# Altium schematic sheet MCH_FPGA_Decoupling.SchDoc: Metlino
size 420 x 297 mm; CheckedBy: P.Kulik,T.Przywozki,W.Ruclo; Author: G.Kasprowicz; CompanyName: WUT ISE; DrawnBy: G.Kasprowicz; Organization: WUT ISE; Address1: PW ISE; Address2: Nowowiejska 15/19 00-665 Warsaw; Address3: gkasprow@gmail.com; DocumentNumber: 11; Revision: 2; SheetNumber: 11; SheetTotal: 29; ModifiedBy: -; CheckedDate: -; Title2: FPGA decoupling; DivGrp: WUT ISE; Designer: G.Kasprowicz; ModifiedDate: -; ProjectName: Sensor Box
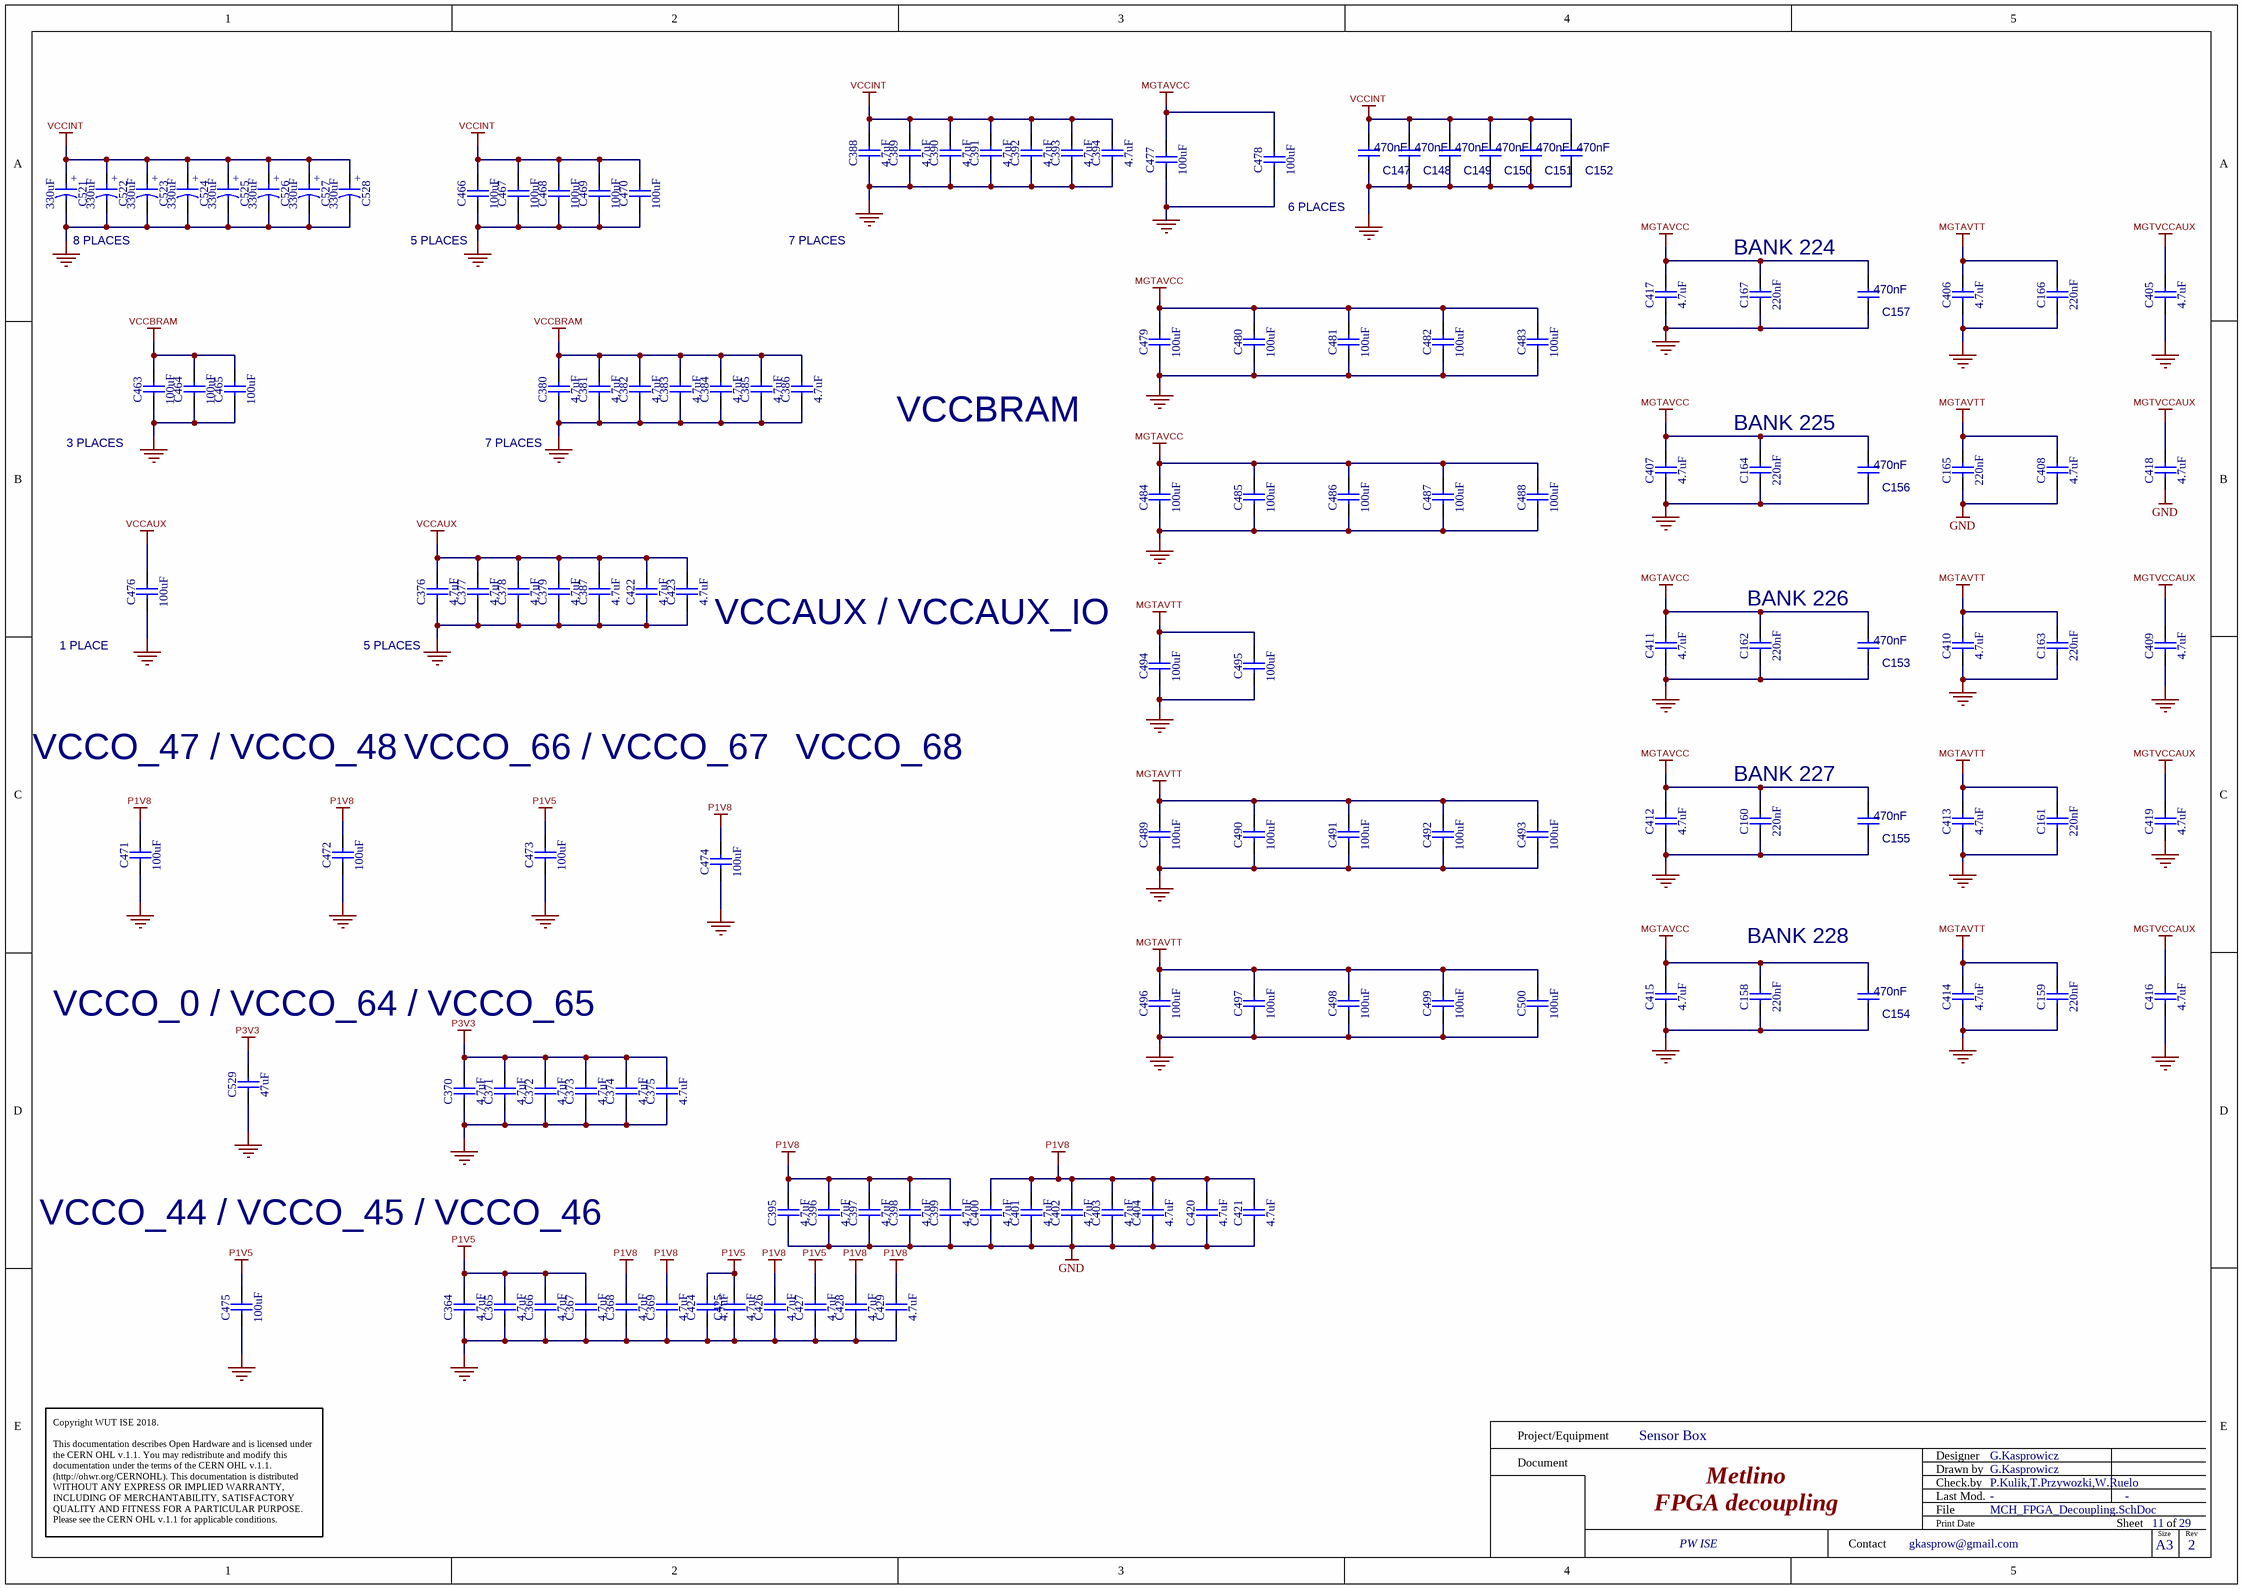
[diagram p0: MCH_FPGA_Decoupling.SchDoc]

## Parts
C147  470nF  [CAPC0603X33N]
C148  470nF  [CAPC0603X33N]
C149  470nF  [CAPC0603X33N]
C150  470nF  [CAPC0603X33N]
C151  470nF  [CAPC0603X33N]
C152  470nF  [CAPC0603X33N]
C153  470nF  [CAPC0603X33N]
C154  470nF  [CAPC0603X33N]
C155  470nF  [CAPC0603X33N]
C156  470nF  [CAPC0603X33N]
C157  470nF  [CAPC0603X33N]
C158  220nF  [CAPC0603X33N]
C159  220nF  [CAPC0603X33N]
C160  220nF  [CAPC0603X33N]
C161  220nF  [CAPC0603X33N]
C162  220nF  [CAPC0603X33N]
C163  220nF  [CAPC0603X33N]
C164  220nF  [CAPC0603X33N]
C165  220nF  [CAPC0603X33N]
C166  220nF  [CAPC0603X33N]
C167  220nF  [CAPC0603X33N]
C364  4.7uF  [CAPC1005X55N]
C365  4.7uF  [CAPC1005X55N]
C366  4.7uF  [CAPC1005X55N]
C367  4.7uF  [CAPC1005X55N]
C368  4.7uF  [CAPC1005X55N]
C369  4.7uF  [CAPC1005X55N]
C370  4.7uF  [CAPC1005X55N]
C371  4.7uF  [CAPC1005X55N]
C372  4.7uF  [CAPC1005X55N]
C373  4.7uF  [CAPC1005X55N]
C374  4.7uF  [CAPC1005X55N]
C375  4.7uF  [CAPC1005X55N]
C376  4.7uF  [CAPC1005X55N]
C377  4.7uF  [CAPC1005X55N]
C378  4.7uF  [CAPC1005X55N]
C379  4.7uF  [CAPC1005X55N]
C380  4.7uF  [CAPC1005X55N]
C381  4.7uF  [CAPC1005X55N]
C382  4.7uF  [CAPC1005X55N]
C383  4.7uF  [CAPC1005X55N]
C384  4.7uF  [CAPC1005X55N]
C385  4.7uF  [CAPC1005X55N]
C386  4.7uF  [CAPC1005X55N]
C387  4.7uF  [CAPC1005X55N]
C388  4.7uF  [CAPC1005X55N]
C389  4.7uF  [CAPC1005X55N]
C390  4.7uF  [CAPC1005X55N]
C391  4.7uF  [CAPC1005X55N]
C392  4.7uF  [CAPC1005X55N]
C393  4.7uF  [CAPC1005X55N]
C394  4.7uF  [CAPC1005X55N]
C395  4.7uF  [CAPC1005X55N]
C396  4.7uF  [CAPC1005X55N]
C397  4.7uF  [CAPC1005X55N]
C398  4.7uF  [CAPC1005X55N]
C399  4.7uF  [CAPC1005X55N]
C400  4.7uF  [CAPC1005X55N]
C401  4.7uF  [CAPC1005X55N]
C402  4.7uF  [CAPC1005X55N]
C403  4.7uF  [CAPC1005X55N]
C404  4.7uF  [CAPC1005X55N]
C405  4.7uF  [CAPC1005X55N]
C406  4.7uF  [CAPC1005X55N]
C407  4.7uF  [CAPC1005X55N]
C408  4.7uF  [CAPC1005X55N]
C409  4.7uF  [CAPC1005X55N]
C410  4.7uF  [CAPC1005X55N]
C411  4.7uF  [CAPC1005X55N]
C412  4.7uF  [CAPC1005X55N]
C413  4.7uF  [CAPC1005X55N]
C414  4.7uF  [CAPC1005X55N]
C415  4.7uF  [CAPC1005X55N]
C416  4.7uF  [CAPC1005X55N]
C417  4.7uF  [CAPC1005X55N]
C418  4.7uF  [CAPC1005X55N]
C419  4.7uF  [CAPC1005X55N]
C420  4.7uF  [CAPC1005X55N]
C421  4.7uF  [CAPC1005X55N]
C422  4.7uF  [CAPC1005X55N]
C423  4.7uF  [CAPC1005X55N]
C424  4.7uF  [CAPC1005X55N]
C425  4.7uF  [CAPC1005X55N]
C426  4.7uF  [CAPC1005X55N]
C427  4.7uF  [CAPC1005X55N]
C428  4.7uF  [CAPC1005X55N]
C429  4.7uF  [CAPC1005X55N]
C463  100uF  [CAPC3216X180N]
C464  100uF  [CAPC3216X180N]
C465  100uF  [CAPC3216X180N]
C466  100uF  [CAPC3216X180N]
C467  100uF  [CAPC3216X180N]
C468  100uF  [CAPC3216X180N]
C469  100uF  [CAPC3216X180N]
C470  100uF  [CAPC3216X180N]
C471  100uF  [CAPC3216X180N]
C472  100uF  [CAPC3216X180N]
C473  100uF  [CAPC3216X180N]
C474  100uF  [CAPC3216X180N]
C475  100uF  [CAPC3216X180N]
C476  100uF  [CAPC3216X180N]
C477  100uF  [CAPC3216X180N]
C478  100uF  [CAPC3216X180N]
C479  100uF  [CAPC3216X180N]
C480  100uF  [CAPC3216X180N]
C481  100uF  [CAPC3216X180N]
C482  100uF  [CAPC3216X180N]
C483  100uF  [CAPC3216X180N]
C484  100uF  [CAPC3216X180N]
C485  100uF  [CAPC3216X180N]
C486  100uF  [CAPC3216X180N]
C487  100uF  [CAPC3216X180N]
C488  100uF  [CAPC3216X180N]
C489  100uF  [CAPC3216X180N]
C490  100uF  [CAPC3216X180N]
C491  100uF  [CAPC3216X180N]
C492  100uF  [CAPC3216X180N]
C493  100uF  [CAPC3216X180N]
C494  100uF  [CAPC3216X180N]
C495  100uF  [CAPC3216X180N]
C496  100uF  [CAPC3216X180N]
C497  100uF  [CAPC3216X180N]
C498  100uF  [CAPC3216X180N]
C499  100uF  [CAPC3216X180N]
C500  100uF  [CAPC3216X180N]
C521  330uF  [CAPMP3528X210N]
C522  330uF  [CAPMP3528X210N]
C523  330uF  [CAPMP3528X210N]
C524  330uF  [CAPMP3528X210N]
C525  330uF  [CAPMP3528X210N]
C526  330uF  [CAPMP3528X210N]
C527  330uF  [CAPMP3528X210N]
C528  330uF  [CAPMP3528X210N]
C529  47uF  [CAPC3225X270N]

## Nets
GND: C147.1 C148.1 C149.1 C150.1 C151.1 C152.1 C153.1 C154.1 C155.1 C156.1 C157.1 C158.1 C159.1 C160.1 C161.1 C162.1 C163.1 C164.1 C165.1 C166.1 C167.1 C364.1 C365.1 C366.1 C367.1 C368.1 C369.1 C370.1 C371.1 C372.1 C373.1 C374.1 C375.1 C376.1 C377.1 C378.1 C379.1 C380.1 C381.1 C382.1 C383.1 C384.1 C385.1 C386.1 C387.1 C388.1 C389.1 C390.1 C391.1 C392.1 C393.1 C394.1 C395.1 C396.1 C397.1 C398.1 C399.1 C400.1 C401.1 C402.1 C403.1 C404.1 C405.1 C406.1 C407.1 C408.1 C409.1 C410.1 C411.1 C412.1 C413.1 C414.1 C415.1 C416.1 C417.1 C418.1 C419.1 C420.1 C421.1 C422.1 C423.1 C424.1 C425.1 C426.1 C427.1 C428.1 C429.1 C463.1 C464.1 C465.1 C466.1 C467.1 C468.1 C469.1 C470.1 C471.1 C472.1 C473.1 C474.1 C475.1 C476.1 C477.1 C478.1 C479.1 C480.1 C481.1 C482.1 C483.1 C484.1 C485.1 C486.1 C487.1 C488.1 C489.1 C490.1 C491.1 C492.1 C493.1 C494.1 C495.1 C496.1 C497.1 C498.1 C499.1 C500.1 C521.2 C522.2 C523.2 C524.2 C525.2 C526.2 C527.2 C528.2 C529.1
MGTAVCC: C153.2 C154.2 C155.2 C156.2 C157.2 C158.2 C160.2 C162.2 C164.2 C167.2 C407.2 C411.2 C412.2 C415.2 C417.2 C477.2 C478.2 C479.2 C480.2 C481.2 C482.2 C483.2 C484.2 C485.2 C486.2 C487.2 C488.2
MGTAVTT: C159.2 C161.2 C163.2 C165.2 C166.2 C406.2 C408.2 C410.2 C413.2 C414.2 C489.2 C490.2 C491.2 C492.2 C493.2 C494.2 C495.2 C496.2 C497.2 C498.2 C499.2 C500.2
MGTVCCAUX: C405.2 C409.2 C416.2 C418.2 C419.2
P1V5: C364.2 C365.2 C366.2 C367.2 C424.2 C425.2 C427.2 C473.2 C475.2
P1V8: C368.2 C369.2 C395.2 C396.2 C397.2 C398.2 C399.2 C400.2 C401.2 C402.2 C403.2 C404.2 C420.2 C421.2 C426.2 C428.2 C429.2 C471.2 C472.2 C474.2
P3V3: C370.2 C371.2 C372.2 C373.2 C374.2 C375.2 C529.2
VCCAUX: C376.2 C377.2 C378.2 C379.2 C387.2 C422.2 C423.2 C476.2
VCCBRAM: C380.2 C381.2 C382.2 C383.2 C384.2 C385.2 C386.2 C463.2 C464.2 C465.2
VCCINT: C147.2 C148.2 C149.2 C150.2 C151.2 C152.2 C388.2 C389.2 C390.2 C391.2 C392.2 C393.2 C394.2 C466.2 C467.2 C468.2 C469.2 C470.2 C521.1 C522.1 C523.1 C524.1 C525.1 C526.1 C527.1 C528.1

## Notes on the sheet
- 8 PLACES
- (near C466) 5 PLACES
- 7 PLACES
- 6 PLACES
- (near C167) BANK 224
- 3 PLACES
- (near C380) 7 PLACES
- VCCBRAM
- (near C164) BANK 225
- BANK 226
- 1 PLACE
- (near C376) 5 PLACES
- (near C423) VCCAUX / VCCAUX_IO
- VCCO_47 / VCCO_48
- VCCO_66 / VCCO_67
- VCCO_68
- (near C160) BANK 227
- BANK 228
- VCCO_0 / VCCO_64 / VCCO_65
- VCCO_44 / VCCO_45 / VCCO_46
- Project/Equipment
- Document
- Designer
- Drawn by
- Check.by
- Copyright WUT ISE 2018.
  This documentation describes Open Hardware and is licensed under the CERN OHL v.1.1. You may redistribute and modify this documentation under the terms of the CERN OHL v.1.1. (http://ohwr.org/CERNOHL). This documentation is distributed WITHOUT ANY EXPRESS OR IMPLIED WARRANTY, INCLUDING OF MERCHANTABILITY, SATISFACTORY QUALITY AND FITNESS FOR A PARTICULAR PURPOSE. Please see the CERN OHL v.1.1 for applicable conditions.
- Contact
- File
- Last Mod.
- Print Date
- Sheet
- Size
- A3
- of
- Rev
- (in symbol CTE3528-21_330UF_2.5V_20%_LESR0015_KEMET_T520) +

## Library data of the parts
C147 = CAPC0603X33N: $$NotCommonProperty_General Part Number: CC0201_470NF_4V_20%_X5R; $$NotCommonProperty_Manufacturer1 Example: TAIYO YUDEN; $$NotCommonProperty_Manufacturer1 Part Number: AMK063BJ474MP-F; Manufacturer: GENERIC; Part Description: SMD Multilayer Chip Ceramic Capacitor; Part Name: Capacitor - non polarized CAPC0603X33N; $$Internal_Resolution: 00001mm; $$NotCommonProperty_Case: 0201; $$NotCommonProperty_Pin Count: 2; $$NotCommonProperty_SMD: Yes; $$NotCommonProperty_Status: Not Recommended; $$NotCommonProperty_TC: X5R; $$NotCommonProperty_Voltage: 4V; CmpIndex: 875; DXDB_LIBNAME: Capacitors SMD; Ref Designator: C147; SymIndex: 331; Tolerance: ±20%; Cell Name: CAPC0603X33N; Manufacturer Part Number: CC0201_470NF_4V_20%_X5R; Part Number: Capacitor - non polarized CAPC0603X33N; Value: 470nF; Orientation: 1 = 1
C148 = CAPC0603X33N: $$NotCommonProperty_General Part Number: CC0201_470NF_4V_20%_X5R; $$NotCommonProperty_Manufacturer1 Example: TAIYO YUDEN; $$NotCommonProperty_Manufacturer1 Part Number: AMK063BJ474MP-F; Manufacturer: GENERIC; Part Description: SMD Multilayer Chip Ceramic Capacitor; Part Name: Capacitor - non polarized CAPC0603X33N; $$Internal_Resolution: 00001mm; $$NotCommonProperty_Case: 0201; $$NotCommonProperty_Pin Count: 2; $$NotCommonProperty_SMD: Yes; $$NotCommonProperty_Status: Not Recommended; $$NotCommonProperty_TC: X5R; $$NotCommonProperty_Voltage: 4V; CmpIndex: 896; DXDB_LIBNAME: Capacitors SMD; Ref Designator: C148; SymIndex: 331; Tolerance: ±20%; Cell Name: CAPC0603X33N; Manufacturer Part Number: CC0201_470NF_4V_20%_X5R; Part Number: Capacitor - non polarized CAPC0603X33N; Value: 470nF; Orientation: 1 = 1
C149 = CAPC0603X33N: $$NotCommonProperty_General Part Number: CC0201_470NF_4V_20%_X5R; $$NotCommonProperty_Manufacturer1 Example: TAIYO YUDEN; $$NotCommonProperty_Manufacturer1 Part Number: AMK063BJ474MP-F; Manufacturer: GENERIC; Part Description: SMD Multilayer Chip Ceramic Capacitor; Part Name: Capacitor - non polarized CAPC0603X33N; $$Internal_Resolution: 00001mm; $$NotCommonProperty_Case: 0201; $$NotCommonProperty_Pin Count: 2; $$NotCommonProperty_SMD: Yes; $$NotCommonProperty_Status: Not Recommended; $$NotCommonProperty_TC: X5R; $$NotCommonProperty_Voltage: 4V; CmpIndex: 1012; DXDB_LIBNAME: Capacitors SMD; Ref Designator: C149; SymIndex: 331; Tolerance: ±20%; Cell Name: CAPC0603X33N; Manufacturer Part Number: CC0201_470NF_4V_20%_X5R; Part Number: Capacitor - non polarized CAPC0603X33N; Value: 470nF; Orientation: 1 = 1
C150 = CAPC0603X33N: $$NotCommonProperty_General Part Number: CC0201_470NF_4V_20%_X5R; $$NotCommonProperty_Manufacturer1 Example: TAIYO YUDEN; $$NotCommonProperty_Manufacturer1 Part Number: AMK063BJ474MP-F; Manufacturer: GENERIC; Part Description: SMD Multilayer Chip Ceramic Capacitor; Part Name: Capacitor - non polarized CAPC0603X33N; $$Internal_Resolution: 00001mm; $$NotCommonProperty_Case: 0201; $$NotCommonProperty_Pin Count: 2; $$NotCommonProperty_SMD: Yes; $$NotCommonProperty_Status: Not Recommended; $$NotCommonProperty_TC: X5R; $$NotCommonProperty_Voltage: 4V; CmpIndex: 1016; DXDB_LIBNAME: Capacitors SMD; Ref Designator: C150; SymIndex: 331; Tolerance: ±20%; Cell Name: CAPC0603X33N; Manufacturer Part Number: CC0201_470NF_4V_20%_X5R; Part Number: Capacitor - non polarized CAPC0603X33N; Value: 470nF; Orientation: 1 = 1
C151 = CAPC0603X33N: $$NotCommonProperty_General Part Number: CC0201_470NF_4V_20%_X5R; $$NotCommonProperty_Manufacturer1 Example: TAIYO YUDEN; $$NotCommonProperty_Manufacturer1 Part Number: AMK063BJ474MP-F; Manufacturer: GENERIC; Part Description: SMD Multilayer Chip Ceramic Capacitor; Part Name: Capacitor - non polarized CAPC0603X33N; $$Internal_Resolution: 00001mm; $$NotCommonProperty_Case: 0201; $$NotCommonProperty_Pin Count: 2; $$NotCommonProperty_SMD: Yes; $$NotCommonProperty_Status: Not Recommended; $$NotCommonProperty_TC: X5R; $$NotCommonProperty_Voltage: 4V; CmpIndex: 916; DXDB_LIBNAME: Capacitors SMD; Ref Designator: C151; SymIndex: 331; Tolerance: ±20%; Cell Name: CAPC0603X33N; Manufacturer Part Number: CC0201_470NF_4V_20%_X5R; Part Number: Capacitor - non polarized CAPC0603X33N; Value: 470nF; Orientation: 1 = 1
C152 = CAPC0603X33N: $$NotCommonProperty_General Part Number: CC0201_470NF_4V_20%_X5R; $$NotCommonProperty_Manufacturer1 Example: TAIYO YUDEN; $$NotCommonProperty_Manufacturer1 Part Number: AMK063BJ474MP-F; Manufacturer: GENERIC; Part Description: SMD Multilayer Chip Ceramic Capacitor; Part Name: Capacitor - non polarized CAPC0603X33N; $$Internal_Resolution: 00001mm; $$NotCommonProperty_Case: 0201; $$NotCommonProperty_Pin Count: 2; $$NotCommonProperty_SMD: Yes; $$NotCommonProperty_Status: Not Recommended; $$NotCommonProperty_TC: X5R; $$NotCommonProperty_Voltage: 4V; CmpIndex: 993; DXDB_LIBNAME: Capacitors SMD; Ref Designator: C152; SymIndex: 331; Tolerance: ±20%; Cell Name: CAPC0603X33N; Manufacturer Part Number: CC0201_470NF_4V_20%_X5R; Part Number: Capacitor - non polarized CAPC0603X33N; Value: 470nF; Orientation: 1 = 1
C153 = CAPC0603X33N: $$NotCommonProperty_General Part Number: CC0201_470NF_4V_20%_X5R; $$NotCommonProperty_Manufacturer1 Example: TAIYO YUDEN; $$NotCommonProperty_Manufacturer1 Part Number: AMK063BJ474MP-F; Manufacturer: GENERIC; Part Description: SMD Multilayer Chip Ceramic Capacitor; Part Name: Capacitor - non polarized CAPC0603X33N; $$Internal_Resolution: 00001mm; $$NotCommonProperty_Case: 0201; $$NotCommonProperty_Pin Count: 2; $$NotCommonProperty_SMD: Yes; $$NotCommonProperty_Status: Not Recommended; $$NotCommonProperty_TC: X5R; $$NotCommonProperty_Voltage: 4V; CmpIndex: 1018; DXDB_LIBNAME: Capacitors SMD; Ref Designator: C153; SymIndex: 331; Tolerance: ±20%; Cell Name: CAPC0603X33N; Manufacturer Part Number: CC0201_470NF_4V_20%_X5R; Part Number: Capacitor - non polarized CAPC0603X33N; Value: 470nF; Orientation: 1 = 1
C154 = CAPC0603X33N: $$NotCommonProperty_General Part Number: CC0201_470NF_4V_20%_X5R; $$NotCommonProperty_Manufacturer1 Example: TAIYO YUDEN; $$NotCommonProperty_Manufacturer1 Part Number: AMK063BJ474MP-F; Manufacturer: GENERIC; Part Description: SMD Multilayer Chip Ceramic Capacitor; Part Name: Capacitor - non polarized CAPC0603X33N; $$Internal_Resolution: 00001mm; $$NotCommonProperty_Case: 0201; $$NotCommonProperty_Pin Count: 2; $$NotCommonProperty_SMD: Yes; $$NotCommonProperty_Status: Not Recommended; $$NotCommonProperty_TC: X5R; $$NotCommonProperty_Voltage: 4V; CmpIndex: 855; DXDB_LIBNAME: Capacitors SMD; Ref Designator: C154; SymIndex: 331; Tolerance: ±20%; Cell Name: CAPC0603X33N; Manufacturer Part Number: CC0201_470NF_4V_20%_X5R; Part Number: Capacitor - non polarized CAPC0603X33N; Value: 470nF; Orientation: 1 = 1
C155 = CAPC0603X33N: $$NotCommonProperty_General Part Number: CC0201_470NF_4V_20%_X5R; $$NotCommonProperty_Manufacturer1 Example: TAIYO YUDEN; $$NotCommonProperty_Manufacturer1 Part Number: AMK063BJ474MP-F; Manufacturer: GENERIC; Part Description: SMD Multilayer Chip Ceramic Capacitor; Part Name: Capacitor - non polarized CAPC0603X33N; $$Internal_Resolution: 00001mm; $$NotCommonProperty_Case: 0201; $$NotCommonProperty_Pin Count: 2; $$NotCommonProperty_SMD: Yes; $$NotCommonProperty_Status: Not Recommended; $$NotCommonProperty_TC: X5R; $$NotCommonProperty_Voltage: 4V; CmpIndex: 975; DXDB_LIBNAME: Capacitors SMD; Ref Designator: C155; SymIndex: 331; Tolerance: ±20%; Cell Name: CAPC0603X33N; Manufacturer Part Number: CC0201_470NF_4V_20%_X5R; Part Number: Capacitor - non polarized CAPC0603X33N; Value: 470nF; Orientation: 1 = 1
C156 = CAPC0603X33N: $$NotCommonProperty_General Part Number: CC0201_470NF_4V_20%_X5R; $$NotCommonProperty_Manufacturer1 Example: TAIYO YUDEN; $$NotCommonProperty_Manufacturer1 Part Number: AMK063BJ474MP-F; Manufacturer: GENERIC; Part Description: SMD Multilayer Chip Ceramic Capacitor; Part Name: Capacitor - non polarized CAPC0603X33N; $$Internal_Resolution: 00001mm; $$NotCommonProperty_Case: 0201; $$NotCommonProperty_Pin Count: 2; $$NotCommonProperty_SMD: Yes; $$NotCommonProperty_Status: Not Recommended; $$NotCommonProperty_TC: X5R; $$NotCommonProperty_Voltage: 4V; CmpIndex: 865; DXDB_LIBNAME: Capacitors SMD; Ref Designator: C156; SymIndex: 331; Tolerance: ±20%; Cell Name: CAPC0603X33N; Manufacturer Part Number: CC0201_470NF_4V_20%_X5R; Part Number: Capacitor - non polarized CAPC0603X33N; Value: 470nF; Orientation: 1 = 1
C157 = CAPC0603X33N: $$NotCommonProperty_General Part Number: CC0201_470NF_4V_20%_X5R; $$NotCommonProperty_Manufacturer1 Example: TAIYO YUDEN; $$NotCommonProperty_Manufacturer1 Part Number: AMK063BJ474MP-F; Manufacturer: GENERIC; Part Description: SMD Multilayer Chip Ceramic Capacitor; Part Name: Capacitor - non polarized CAPC0603X33N; $$Internal_Resolution: 00001mm; $$NotCommonProperty_Case: 0201; $$NotCommonProperty_Pin Count: 2; $$NotCommonProperty_SMD: Yes; $$NotCommonProperty_Status: Not Recommended; $$NotCommonProperty_TC: X5R; $$NotCommonProperty_Voltage: 4V; CmpIndex: 944; DXDB_LIBNAME: Capacitors SMD; Ref Designator: C157; SymIndex: 331; Tolerance: ±20%; Cell Name: CAPC0603X33N; Manufacturer Part Number: CC0201_470NF_4V_20%_X5R; Part Number: Capacitor - non polarized CAPC0603X33N; Value: 470nF; Orientation: 1 = 1
C158-C167 = CC0201_220NF_6.3V_20%_X5R: Non-polarised capacitor; Manufacturer: GENERIC; Part Description: SMD Multilayer Chip Ceramic Capacitor; Manufacturer1 Part Number: JMK063BJ224MP-F; Tolerance: ±20%; Voltage: 6.3V; TC: X5R; Manufacturer Part Number: CC0201_220NF_6.3V_20%_X5R; Part Number: CC0201_220NF_6.3V_20%_X5R; Value: 220nF; Component Kind: Standard; Component Type: Standard; Pin Count: 2; Status: Not Recommended; Case: 0201; Mounted: Yes; Socket: No; SMD: Yes; Sense: No; Manufacturer1 Example: TAIYO YUDEN; Manufacturer1 ComponentHeight: 0.33mm; HelpURL: \\cern.ch\dfs\Applications\Altium\Datasheets\CC0201_X5R_TAIYO-YUDEN_STANDARD-CLASS2.pdf; Author: CERN DEM JLC; CreateDate: 27.05.2010; LatestRevisionDate: 27.05.2010
C364-C429 = CC0402_4.7UF_6.3V_20%_X5R: Non-polarised capacitor; Manufacturer: GENERIC; Part Description: SMD Multilayer Chip Ceramic Capacitor; Manufacturer1 Part Number: C1005X5R0J475M050BC; Tolerance: ±20%; Voltage: 6.3V; TC: X5R; Manufacturer Part Number: CC0402_4.7UF_6.3V_20%_X5R; Part Number: CC0402_4.7UF_6.3V_20%_X5R; Value: 4.7uF; Component Kind: Standard; Component Type: Standard; Pin Count: 2; Status: Preferred; Case: 0402; Mounted: Yes; Socket: No; SMD: Yes; Sense: No; Manufacturer1 Example: TDK; Manufacturer1 ComponentHeight: 0.65mm; HelpURL: \\cern.ch\dfs\Applications\Altium\Datasheets\CC0402_X5R_TDK_C.pdf; Author: CERN DEM JLC; CreateDate: 03.03.2015; LatestRevisionDate: 03.03.2015
C463-C500 = CC1206_100UF_6.3V_20%_X5R: Non-polarised capacitor; Manufacturer: GENERIC; Part Description: SMD Multilayer Chip Ceramic Capacitor; Manufacturer1 Part Number: C1206C107M9PACTU; Tolerance: ±10%; Voltage: 6.3V; TC: X5R; Manufacturer Part Number: CC1206_100UF_6.3V_20%_X5R; Part Number: CC1206_100UF_6.3V_20%_X5R; Value: 100uF; Component Kind: Standard; Component Type: Standard; Pin Count: 2; Status: None; Case: 1206; Mounted: Yes; Socket: No; SMD: Yes; Sense: No; Manufacturer1 Example: KEMET; Manufacturer1 ComponentHeight: 1.8mm; HelpURL: \\cern.ch\dfs\Applications\Altium\Datasheets\CC1206_X5R_KEMET.pdf; Author: CERN DEM JLC; CreateDate: 26.09.2012; LatestRevisionDate: 26.09.2012
C521-C528 = CTE3528-21_330UF_2.5V_20%_LESR0015_KEMET_T520: Polarised capacitor; Manufacturer Part Number: T520B337M2R5ATE015; Manufacturer: KEMET; Part Description: Low ESR 0R015 Tantalum Chip Capacitor; Tolerance: ±20%; Voltage: 2.5V; Part Number: CTE3528-21_330UF_2.5V_20%_LESR0015_KEMET_T520; Value: 330uF; Component Kind: Standard; Component Type: Standard; Pin Count: 2; Status: None; Case: B; Mounted: Yes; Socket: No; SMD: Yes; Sense: No; ComponentHeight: 2.1mm; HelpURL: \\cern.ch\dfs\Applications\Altium\Datasheets\CTE-LESR_KEMET_T520.pdf; Author: CERN DEM JLC; CreateDate: 07.03.2012; LatestRevisionDate: 01.09.2014
C529 = CC1210_47UF_6.3V_10%_X5R: Non-polarised capacitor; Manufacturer: GENERIC; Part Description: SMD Multilayer Chip Ceramic Capacitor; Manufacturer1 Part Number: 12106D476KAT2A; Tolerance: ±10%; Voltage: 6.3V; TC: X5R; Manufacturer Part Number: CC1210_47UF_6.3V_10%_X5R; Part Number: CC1210_47UF_6.3V_10%_X5R; Value: 47uF; Component Kind: Standard; Component Type: Standard; Pin Count: 2; Status: Preferred; Case: 1210; Mounted: Yes; Socket: No; SMD: Yes; Sense: No; Manufacturer1 Example: AVX; Manufacturer1 ComponentHeight: 2.79mm; HelpURL: \\cern.ch\dfs\Applications\Altium\Datasheets\CC1210_X5R_AVX.pdf; Author: CERN DEM JLC; CreateDate: 12.11.2014; LatestRevisionDate: 12.11.2014